# EAGLE design Versorgungseinheit_v1 (EAGLE 6.5.0)
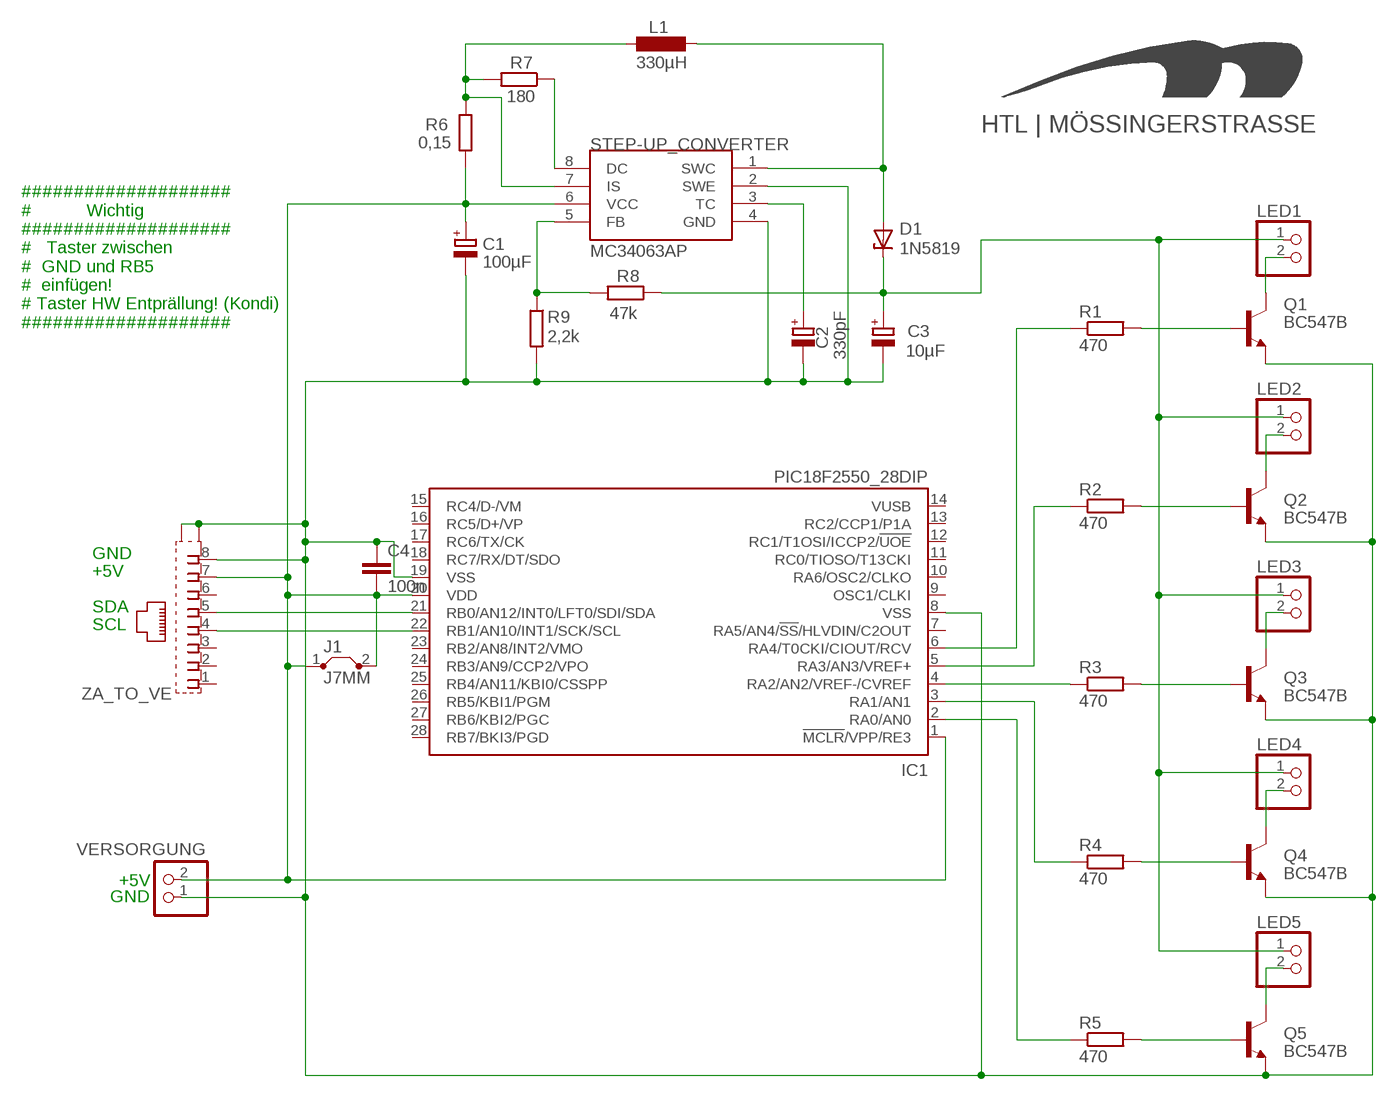
[diagram p0: schematic, sheet 1]

## Parts
C1  100µF  CPOL-EUE5-8.5  [E5-8,5]
C2  330pF  CPOL-EUE5-8.5  [E5-8,5]
C3  10µF  CPOL-EUE5-8.5  [E5-8,5]
C4  100n  C-EU050-025X075  [C050-025X075]
D1  1N5819  1N4728  [DO41Z10]
IC1  PIC18F2550_28DIP  [DIL28-3]
J1  J7MM  [07]
L1  330µH  L-EU0207/10  [0207/10]
LED1  PINHD-1X2  [1X02]
LED2  PINHD-1X2  [1X02]
LED3  PINHD-1X2  [1X02]
LED4  PINHD-1X2  [1X02]
LED5  PINHD-1X2  [1X02]
Q1  BC547B  [TO92]
Q2  BC547B  [TO92]
Q3  BC547B  [TO92]
Q4  BC547B  [TO92]
Q5  BC547B  [TO92]
R1  470  R-EU_0207/10  [0207/10]
R2  470  R-EU_0207/10  [0207/10]
R3  470  R-EU_0207/10  [0207/10]
R4  470  R-EU_0207/10  [0207/10]
R5  470  R-EU_0207/10  [0207/10]
R6  0,15  R-EU_R1206  [R1206]
R7  180  R-EU_0207/10  [0207/10]
R8  47k  R-EU_0207/10  [0207/10]
R9  2,2k  R-EU_0207/10  [0207/10]
STEP-UP_CONVERTER  MC34063AP  [DIL08]
U$2  HTL_LOGOBOT_15MM  [LOGOBOT_15]
VERSORGUNG  PINHD-1X2  [1X02]
ZA_TO_VE  555141-1  [555153-1]

## Nets
N$1: IC1.2(RA0/AN0) R5.1
N$2: IC1.3(RA1/AN1) R4.1
N$3: IC1.6(RA4/T0CKI/CIOUT/RCV) R1.1
N$4: IC1.4(RA2/AN2/VREF-/CVREF) R3.1
N$5: C3.+ D1.C LED1.1 LED2.1 LED3.1 LED4.1 LED5.1 R8.1
N$7: IC1.5(RA3/AN3/VREF+) R2.1
N$8: IC1.22(RB1/AN10/INT1/SCK/SCL) ZA_TO_VE.4
N$9: Q1.2(B) R1.2
N$10: Q2.2(B) R2.2
N$11: Q3.2(B) R3.2
N$12: Q4.2(B) R4.2
N$13: Q5.2(B) R5.2
N$14: LED1.2 Q1.3(C)
N$15: LED2.2 Q2.3(C)
N$16: LED3.2 Q3.3(C)
N$17: LED4.2 Q4.3(C)
N$18: LED5.2 Q5.3(C)
N$19: L1.2 R6.2 R7.2 STEP-UP_CONVERTER.7(IS)
N$20: R7.1 STEP-UP_CONVERTER.8(DC)
N$21: D1.A L1.1 STEP-UP_CONVERTER.1(SWC)
N$22: R8.2 R9.1 STEP-UP_CONVERTER.5(FB)
N$23: C2.+ STEP-UP_CONVERTER.3(TC)
SDA: IC1.21(RB0/AN12/INT0/LFT0/SDI/SDA) ZA_TO_VE.5
VDD: C1.+ C4.2 IC1.1(!MCLR!/VPP/RE3) IC1.20(VDD) J1.1 J1.2 R6.1 STEP-UP_CONVERTER.6(VCC) VERSORGUNG.2 ZA_TO_VE.7
VSS: C1.- C2.- C3.- C4.1 IC1.8(VSS) IC1.19(VSS) Q1.1(E) Q2.1(E) Q3.1(E) Q4.1(E) Q5.1(E) R9.2 STEP-UP_CONVERTER.2(SWE) STEP-UP_CONVERTER.4(GND) VERSORGUNG.1 ZA_TO_VE.8 ZA_TO_VE.G1(S1) ZA_TO_VE.G2(S2)
Unconnected: IC1.7(RA5/AN4/!SS!/HLVDIN/C2OUT) IC1.9(OSC1/CLKI) IC1.10(RA6/OSC2/CLKO) IC1.11(RC0/TIOSO/T13CKI) IC1.12(RC1/T1OSI/ICCP2/!UOE) IC1.13(RC2/CCP1/P1A) IC1.14(VUSB) IC1.15(RC4/D-/VM) IC1.16(RC5/D+/VP) IC1.17(RC6/TX/CK) IC1.18(RC7/RX/DT/SDO) IC1.23(RB2/AN8/INT2/VMO) IC1.24(RB3/AN9/CCP2/VPO) IC1.25(RB4/AN11/KBI0/CSSPP) IC1.26(RB5/KBI1/PGM) IC1.27(RB6/KBI2/PGC) IC1.28(RB7/BKI3/PGD) ZA_TO_VE.1 ZA_TO_VE.2 ZA_TO_VE.3 ZA_TO_VE.6

## Notes on the sheet
- ####################
  #           Wichtig
  ####################
  #   Taster zwischen
  #  GND und RB5
  #  einfügen!
  # Taster HW Entprällung! (Kondi)
  ####################
- GND
- +5V
- SDA
- SCL
- +5V
- GND

## Library data of the parts
C1-C3 = resistor:CPOL-EU: POLARIZED CAPACITOR, European symbol
C4 = resistor:C-EU: CAPACITOR, European symbol
D1 = diode:1N4728: Z DIODE 3.3 V, 1W, 5 percent
IC1 = microchip:PIC18F2*_28: USB Microcontrollers with nanoWatt Technology High-Performance, Enhanced Flash, 28/40/44-Pin, Source: http://ww1.microchip.com/downloads/en/devicedoc/39632c.pdf; MF: MICROCHIP; MPN: PIC18F2550-I/SP; OC_FARNELL: 1523822; OC_NEWARK: 80K6054
J1 = jumper:J: Bridge
L1 = resistor:L-EU: INDUCTOR, European symbol
LED1-LED5 VERSORGUNG = pinhead:PINHD-1X2: PIN HEADER
Q1-Q5 = transistor-npn:BC547*: NPN Transistor
R1-R9 = resistor:R-EU_: RESISTOR, European symbol
STEP-UP_CONVERTER = mc34063:MC34063
U$2 = HTL-Logo:HTL_LOGO
ZA_TO_VE = con-amp:555141-1: AMP connector

## Board
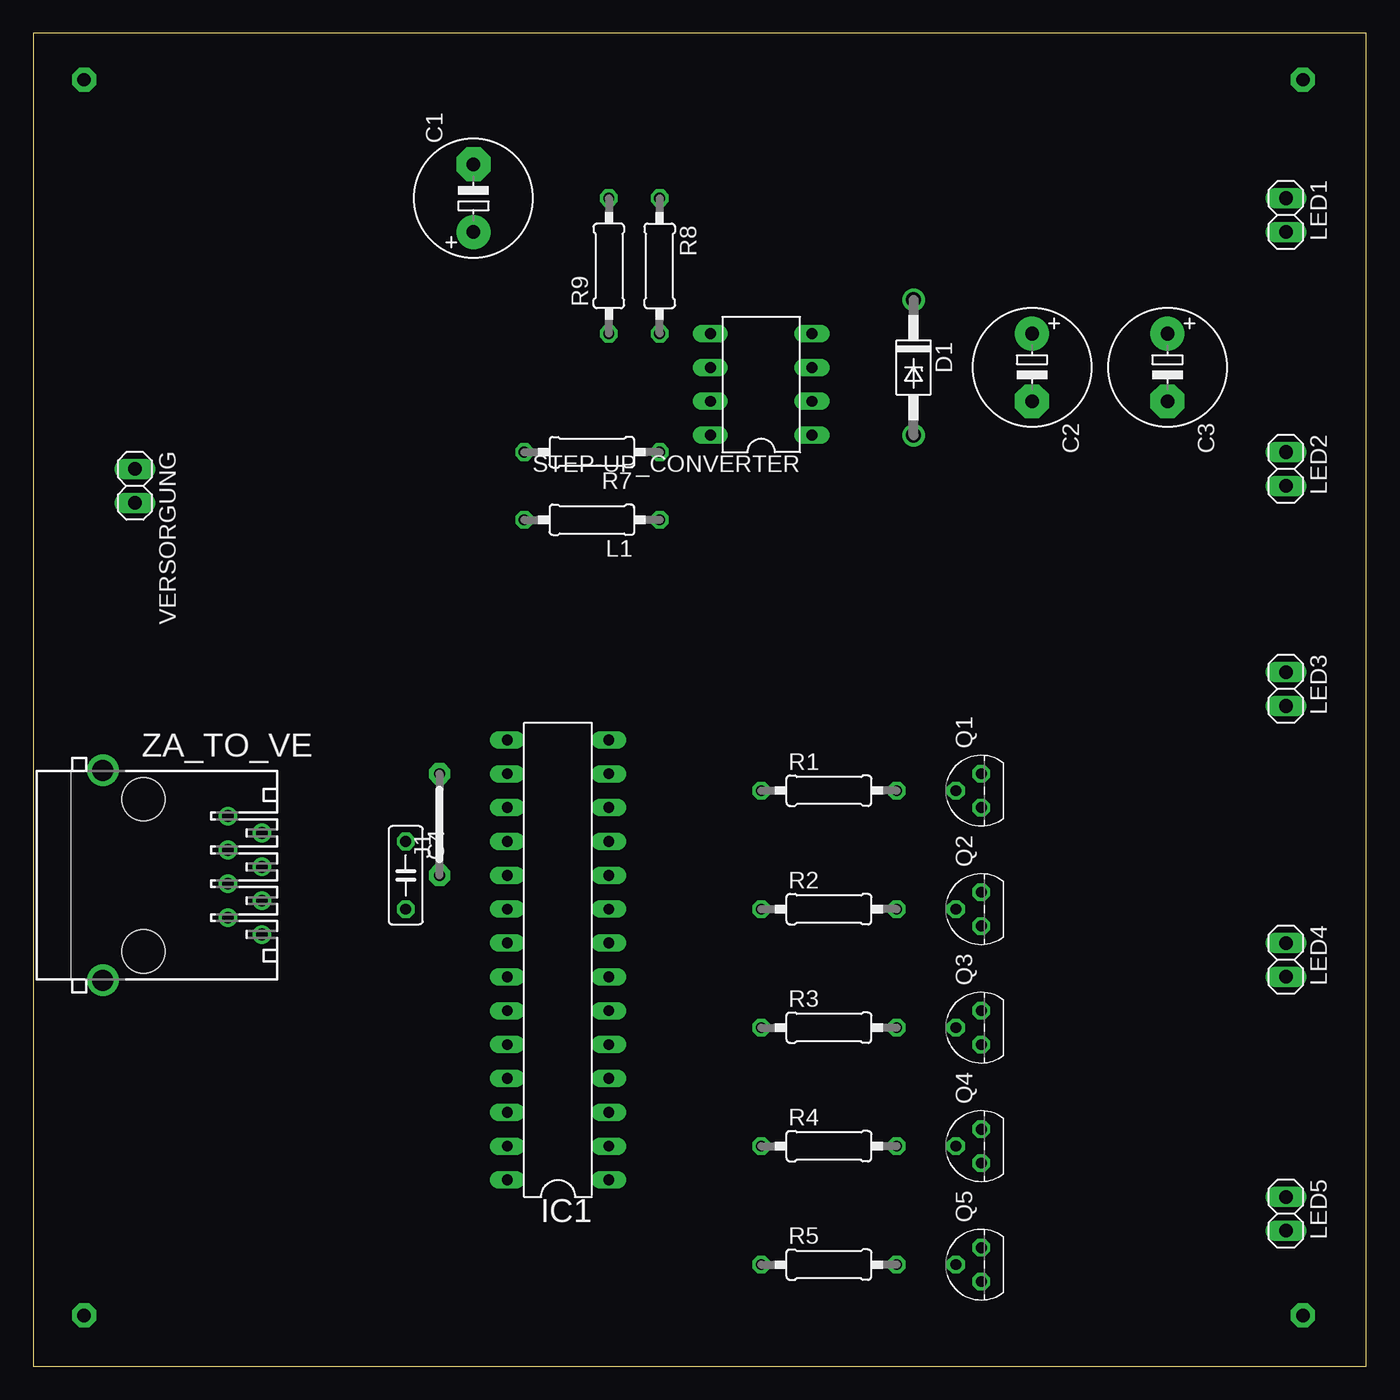
[diagram p1: board, top side]
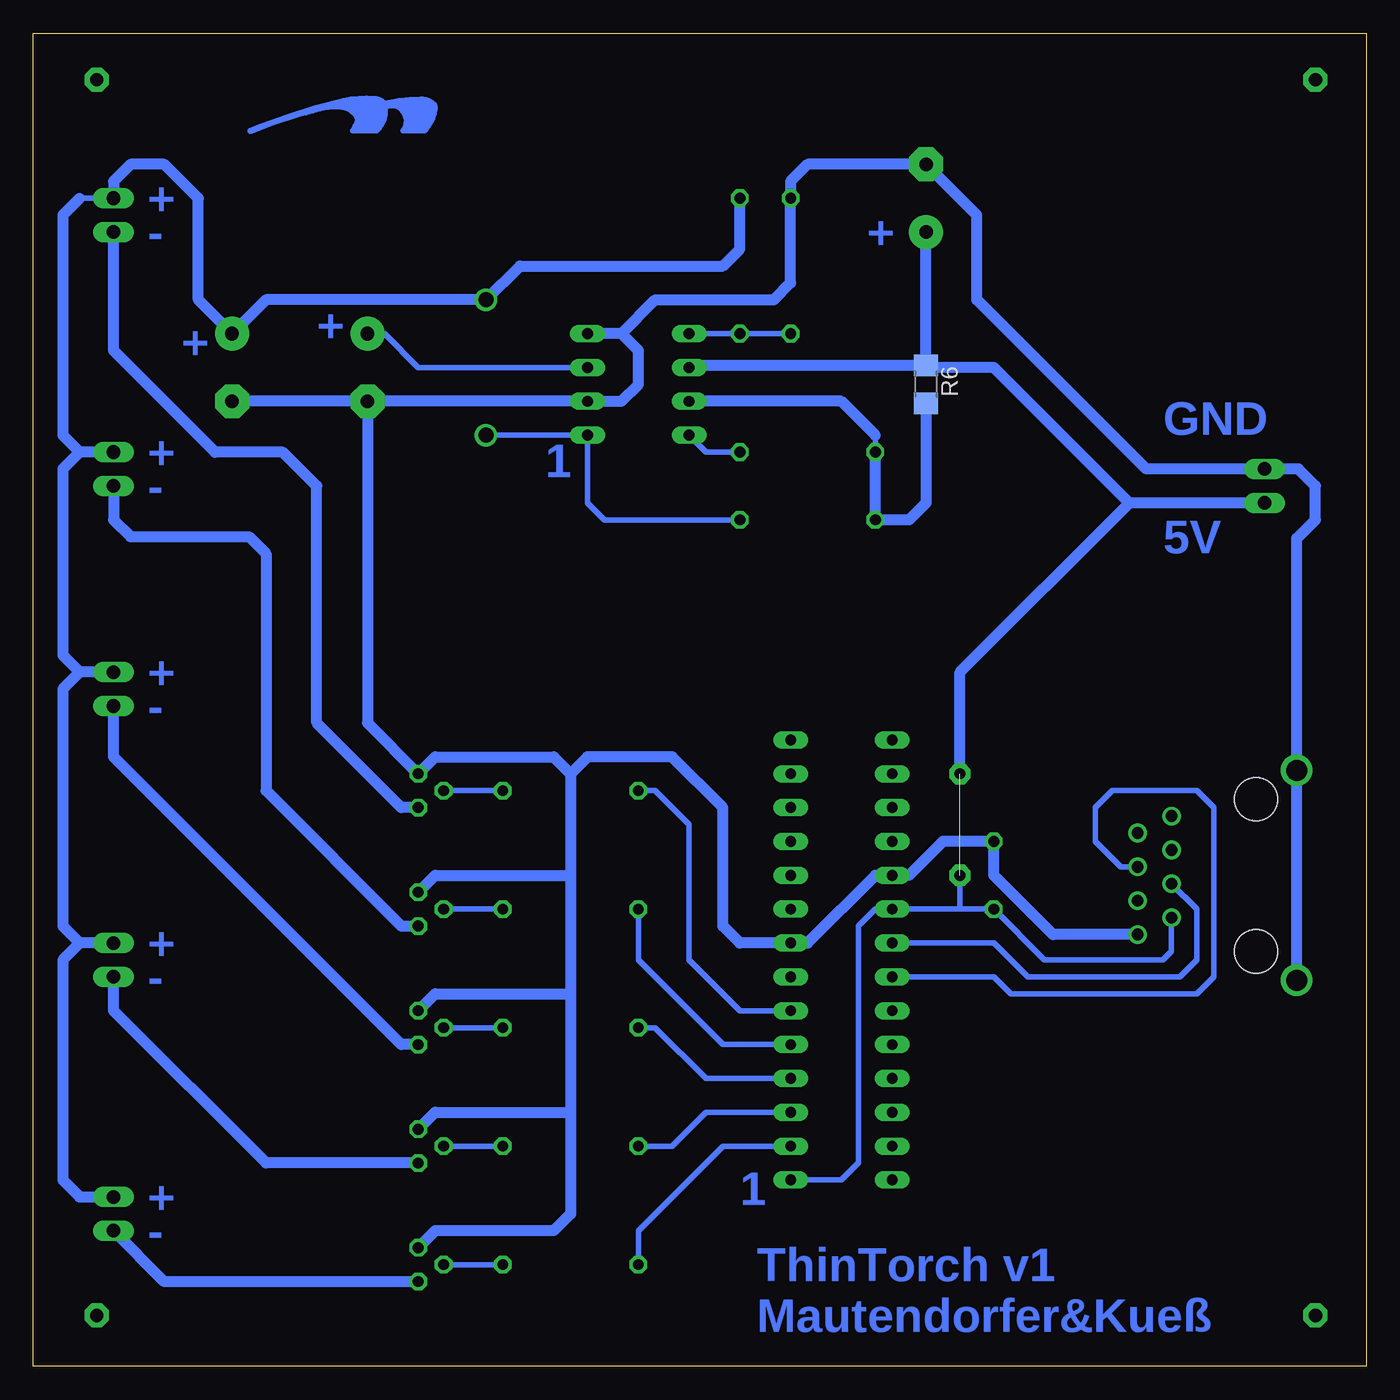
[diagram p2: board, bottom side, seen from below]

Size 100 x 100 mm. Coordinates in mm from the lower left corner, seen from the top.
Outline: 0,0 100,0 100,100 0,100 0,0
Copper layers (1*16): Top 0.035mm / dielectric 1.5mm / Bottom 0.035mm
Design rules "default": minimum track width 16mil, minimum drill 31mil, track to track 16mil, track to pad 16mil, pad to pad 16mil, via to via 16mil, smd to smd 12mil, copper to edge 40mil, drill to drill 16mil, minimum pad ring 10mil, minimum via ring 16mil, stop-mask expansion 4mil, vias tented up to drill 0mil, thermal gap 20mil

### Footprints (pad centres in the part's own frame; a part is rotated, then mirrored left to right if it is on the bottom)
E5-8,5 = drill 1.016 pad 2.54: + -2.54,0 | drill 1.016 pad 2.54 octagon: - 2.54,0
C050-025X075 = drill 0.813 octagon: 1 -2.54,0; 2 2.54,0
DO41Z10 = drill 1.118: A 5.08,0; C -5.08,0
DIL28-3 = drill 0.813 long: 1 -16.51,-3.81; 2 -13.97,-3.81; 3 -11.43,-3.81; 4 -8.89,-3.81; 5 -6.35,-3.81; 6 -3.81,-3.81; 7 -1.27,-3.81; 8 1.27,-3.81; 9 3.81,-3.81; 10 6.35,-3.81; 11 8.89,-3.81; 12 11.43,-3.81; 13 13.97,-3.81; 14 16.51,-3.81; 15 16.51,3.81; 16 13.97,3.81; 17 11.43,3.81; 18 8.89,3.81; 19 6.35,3.81; 20 3.81,3.81; 21 1.27,3.81; 22 -1.27,3.81; 23 -3.81,3.81; 24 -6.35,3.81; 25 -8.89,3.81; 26 -11.43,3.81; 27 -13.97,3.81; 28 -16.51,3.81
07 = drill 0.813 pad 1.6 octagon: 1 -3.81,0; 2 3.81,0
0207/10 = drill 0.813 octagon: 1 -5.08,0; 2 5.08,0
1X02 = drill 1.016 long: 1 -1.27,0; 2 1.27,0
TO92 = drill 0.813 octagon: 1 1.27,0; 2 0,1.905; 3 -1.27,0
R1206 = smd 1.6 x 1.803: 1 -1.422,0; 2 1.422,0
DIL08 = drill 0.813 long: 1 -3.81,-3.81; 2 -1.27,-3.81; 3 1.27,-3.81; 4 3.81,-3.81; 5 3.81,3.81; 6 1.27,3.81; 7 -1.27,3.81; 8 -3.81,3.81
555153-1 = drill 0.889: 1 -4.445,6.35; 2 -3.175,8.89; 3 -1.905,6.35; 4 -0.635,8.89; 5 0.635,6.35; 6 1.905,8.89; 7 3.175,6.35; 8 4.445,8.89 | drill 1.575 pad 2.184: G1 -7.874,-3.048; G2 7.874,-3.048 | hole 3.251: -5.715,0; 5.715,0

### Placement (x,y rotation side)
C1  33.02,87.63 90 top
C2  74.93,74.93 270 top
C3  85.09,74.93 270 top
C4  27.94,36.83 270 top
D1  66.04,74.93 270 top
IC1  39.37,30.48 90 top
J1  30.48,40.64 90 top
L1  41.91,63.5 180 top
LED1  93.98,86.36 270 top
LED2  93.98,67.31 270 top
LED3  93.98,50.8 270 top
LED4  93.98,30.48 270 top
LED5  93.98,11.43 270 top
Q1  71.12,43.18 90 top
Q2  71.12,34.29 90 top
Q3  71.12,25.4 90 top
Q4  71.12,16.51 90 top
Q5  71.12,7.62 90 top
R1  59.69,43.18 0 top
R2  59.69,34.29 0 top
R3  59.69,25.4 0 top
R4  59.69,16.51 0 top
R5  59.69,7.62 0 top
R6  33.02,73.66 270 bottom
R7  41.91,68.58 180 top
R8  46.99,82.55 270 top
R9  43.18,82.55 90 top
STEP-UP_CONVERTER  54.61,73.66 90 top
U$2  74.93,92.71 0 top
VERSORGUNG  7.62,66.04 270 top
ZA_TO_VE  8.26,36.83 270 top

### Tracks (layer width: path | path; a pad name or v marks a point on that pad's centre or on a via)
N$1
  Bottom 0.406: IC1.2 48.26,16.51 54.61,10.16 R5.1
N$2
  Bottom 0.406: IC1.3 49.53,19.05 52.07,16.51 R4.1
N$3
  Bottom 0.406: IC1.6 46.99,26.67 50.8,30.48 50.8,40.64 53.34,43.18 R1.1
N$4
  Bottom 0.406: R3.1 53.34,25.4 49.53,21.59 IC1.4
N$5
  Bottom 0.406: LED1.1 96.52,87.63
  Bottom 0.813: 96.52,87.63 97.79,86.36 97.79,69.85 96.52,68.58 | LED2.1 96.52,68.58 | 96.52,68.58 97.79,67.31 97.79,53.34 96.52,52.07 | LED3.1 96.52,52.07 | 96.52,52.07 97.79,50.8 97.79,33.02 96.52,31.75 | LED4.1 96.52,31.75 | 96.52,31.75 97.79,30.48 97.79,13.97 96.52,12.7 LED5.1 | R8.1 46.99,83.82 48.26,82.55 63.5,82.55 D1.C 82.55,80.01 C3.+ 87.63,80.01 87.63,87.63 90.17,90.17 92.71,90.17 93.98,88.9 LED1.1
N$6  (via drill 1)
  other vias: 3.81,96.52
N$7
  Bottom 0.406: IC1.5 48.26,24.13 54.61,30.48 R2.1
N$8
  Bottom 0.406: IC1.22 27.94,29.21 26.67,27.94 12.7,27.94 11.43,29.21 11.43,41.91 12.7,43.18 19.05,43.18 20.32,41.91 20.32,39.37 18.41,37.47 ZA_TO_VE.4
N$9
  Bottom 0.406: Q1.2 R1.2
N$10
  Bottom 0.406: R2.2 Q2.2
N$11
  Bottom 0.406: R3.2 Q3.2
N$12
  Bottom 0.406: R4.2 Q4.2
N$13
  Bottom 0.406: R5.2 Q5.2
N$14
  Bottom 0.813: Q1.3 72.39,41.91 78.74,48.26 78.74,66.04 81.28,68.58 86.36,68.58 93.98,76.2 LED1.2
N$15
  Bottom 0.813: LED2.2 93.98,63.5 92.71,62.23 83.82,62.23 82.55,60.96 82.55,43.18 72.39,33.02 Q2.3
N$16
  Bottom 0.813: Q3.3 72.39,24.13 93.98,45.72 LED3.2
N$17
  Bottom 0.813: Q4.3 82.55,15.24 93.98,26.67 LED4.2
N$18
  Bottom 0.813: Q5.3 90.17,6.35 LED5.2
N$19
  Bottom 0.406: R7.2 36.83,69.85
  Bottom 0.813: R7.2 L1.2 34.29,63.5 33.02,64.77 R6.2 | 36.83,69.85 39.37,72.39 STEP-UP_CONVERTER.7
N$20
  Bottom 0.406: R7.1 49.53,68.58 STEP-UP_CONVERTER.8
N$21
  Bottom 0.406: D1.A STEP-UP_CONVERTER.1 58.42,64.77 57.15,63.5 L1.1
N$22
  Bottom 0.406: R9.1 R8.2 STEP-UP_CONVERTER.5
N$23
  Bottom 0.406: STEP-UP_CONVERTER.3 71.12,74.93 73.66,77.47 C2.+
N$24  (via drill 1)
  other vias: 95.25,96.52
N$25  (via drill 1)
  other vias: 95.25,3.81
N$26  (via drill 1)
  other vias: 3.81,3.81
SDA
  Bottom 0.406: IC1.21 27.94,31.75 25.4,29.21 13.97,29.21 12.7,30.48 12.7,34.29 ZA_TO_VE.5
VDD  (1 unrouted)
  Bottom 0.406: 50.65,75.08 STEP-UP_CONVERTER.6 | IC1.1 39.37,13.97 38.1,15.24 38.1,33.02 36.83,34.29 IC1.20 30.48,34.29 | ZA_TO_VE.7 14.61,31.11 15.24,30.48 24.13,30.48 C4.2 30.48,34.29 | 32.87,74.93 R6.1 | J1.1 30.48,34.29
  Bottom 0.813: C1.+ R6.1 50.65,75.08 | VERSORGUNG.2 17.78,64.77 | 17.78,64.77 27.94,74.93 32.87,74.93 | J1.2 30.48,52.07 17.78,64.77
VSS
  Bottom 0.406: 41.91,31.75 IC1.8 | 34.29,36.83 IC1.19
  Bottom 0.813: IC1.19 36.83,36.83 41.91,31.75 | 34.29,36.83 31.75,39.37 C4.1 27.94,36.83 23.5,32.38 ZA_TO_VE.8 | ZA_TO_VE.G2 ZA_TO_VE.G1 5.21,62.1 3.81,63.5 3.81,66.04 5.08,67.31 VERSORGUNG.1 16.51,67.31 29.21,80.01 29.21,86.36 C1.- 41.91,90.17 43.18,88.9 R9.2 43.18,81.28 44.45,80.01 53.34,80.01 55.88,77.47 | C2.- C3.- | C2.- STEP-UP_CONVERTER.2 55.88,72.39 54.61,73.66 54.61,76.2 55.88,77.47 | C2.- 74.93,48.26 Q1.1 69.85,45.72 60.96,45.72 59.69,44.45 | 59.69,44.45 59.69,36.83 | 59.69,36.83 59.69,27.94 | 59.69,27.94 59.69,19.05 | 59.69,19.05 59.69,11.43 60.96,10.16 69.85,10.16 Q5.1 | Q4.1 69.85,19.05 59.69,19.05 | Q3.1 69.85,27.94 59.69,27.94 | Q2.1 69.85,36.83 59.69,36.83 | IC1.8 46.99,31.75 48.26,33.02 48.26,41.91 52.07,45.72 58.42,45.72 59.69,44.45 | 55.88,77.47 STEP-UP_CONVERTER.4

### Text on the board
Bottom: + | + | - | + | + | GND | 1 | + | - | 5V | + | - | + | - | 1 | + | - | ThinTorch v1 | Mautendorfer&Kueß